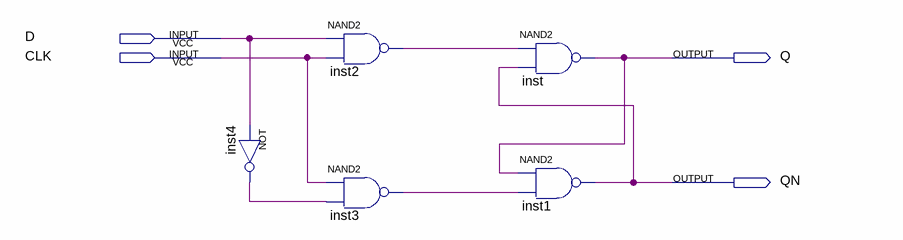
[diagram p0: schematic sheet]
// Quartus schematic lab9step2.bdf as structural Verilog: 5 symbols, 4 pins
module lab9step2 (
  input  D,
  input  CLK,
  output Q,
  output QN
);

  wire inst2_out, inst3_out, inst4_out;

  not inst4 (inst4_out, D);
  nand inst2 (inst2_out, D, CLK);
  nand inst3 (inst3_out, CLK, inst4_out);
  nand inst (Q, inst2_out, QN);
  nand inst1 (QN, Q, inst3_out);
endmodule
